# EAGLE design STM32F446RC_single layer V1 (EAGLE 9.2.0)
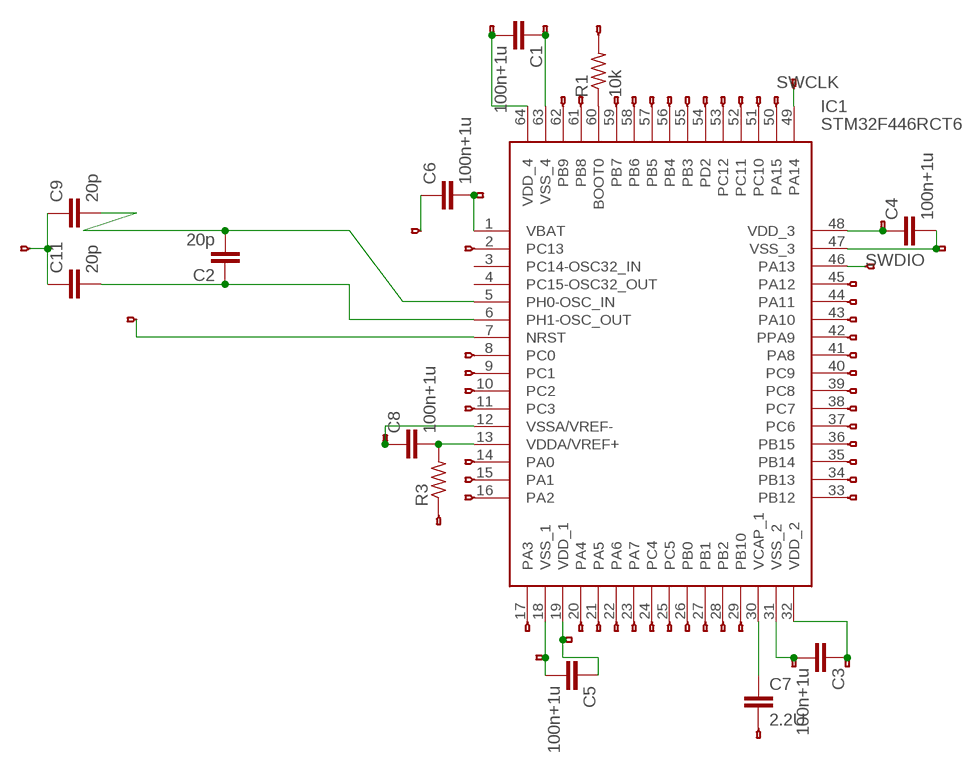
[diagram p0: schematic, sheet 1]

## Parts
C0  HEADERHOLE-HEADERHOLE  [1X1-HEADER-HOLE]
C1  100n+1u  C2,5-3  [C2.5-3]
C2  20p  C2,5-3  [C2.5-3]
C3  100n+1u  C2,5-3  [C2.5-3]
C4  100n+1u  C2,5-3  [C2.5-3]
C5  100n+1u  C2,5-3  [C2.5-3]
C6  100n+1u  C2,5-3  [C2.5-3]
C7  2.2U  C2,5-3  [C2.5-3]
C8  100n+1u  C2,5-3  [C2.5-3]
C9  20p  C2,5-3  [C2.5-3]
C11  20p  C2,5-3  [C2.5-3]
C13  HEADERHOLE-HEADERHOLE  [1X1-HEADER-HOLE]
IC1  STM32F446RCT6  [QFP50P1200X1200X160-64N]
JP1  HEADERHOLE-HEADERHOLE  [1X1-HEADER-HOLE]
JP2  HEADERHOLE-HEADERHOLE  [1X1-HEADER-HOLE]
JP3  HEADERHOLE-HEADERHOLE  [1X1-HEADER-HOLE]
JP4  HEADERHOLE-HEADERHOLE  [1X1-HEADER-HOLE]
JP5  HEADERHOLE-HEADERHOLE  [1X1-HEADER-HOLE]
JP6  HEADERHOLE-HEADERHOLE  [1X1-HEADER-HOLE]
JP7  HEADERHOLE-HEADERHOLE  [1X1-HEADER-HOLE]
JP9  HEADERHOLE-HEADERHOLE  [1X1-HEADER-HOLE]
JP10  HEADERHOLE-HEADERHOLE  [1X1-HEADER-HOLE]
JP11  HEADERHOLE-HEADERHOLE  [1X1-HEADER-HOLE]
JP12  HEADERHOLE-HEADERHOLE  [1X1-HEADER-HOLE]
JP13  HEADERHOLE-HEADERHOLE  [1X1-HEADER-HOLE]
JP14  HEADERHOLE-HEADERHOLE  [1X1-HEADER-HOLE]
JP15  HEADERHOLE-HEADERHOLE  [1X1-HEADER-HOLE]
JP16  HEADERHOLE-HEADERHOLE  [1X1-HEADER-HOLE]
JP17  HEADERHOLE-HEADERHOLE  [1X1-HEADER-HOLE]
JP18  HEADERHOLE-HEADERHOLE  [1X1-HEADER-HOLE]
JP19  HEADERHOLE-HEADERHOLE  [1X1-HEADER-HOLE]
JP20  HEADERHOLE-HEADERHOLE  [1X1-HEADER-HOLE]
JP21  HEADERHOLE-HEADERHOLE  [1X1-HEADER-HOLE]
JP22  HEADERHOLE-HEADERHOLE  [1X1-HEADER-HOLE]
JP23  HEADERHOLE-HEADERHOLE  [1X1-HEADER-HOLE]
JP24  HEADERHOLE-HEADERHOLE  [1X1-HEADER-HOLE]
JP25  HEADERHOLE-HEADERHOLE  [1X1-HEADER-HOLE]
JP27  HEADERHOLE-HEADERHOLE  [1X1-HEADER-HOLE]
JP28  HEADERHOLE-HEADERHOLE  [1X1-HEADER-HOLE]
JP30  HEADERHOLE-HEADERHOLE  [1X1-HEADER-HOLE]
JP31  HEADERHOLE-HEADERHOLE  [1X1-HEADER-HOLE]
JP32  HEADERHOLE-HEADERHOLE  [1X1-HEADER-HOLE]
JP33  HEADERHOLE-HEADERHOLE  [1X1-HEADER-HOLE]
JP34  HEADERHOLE-HEADERHOLE  [1X1-HEADER-HOLE]
JP35  HEADERHOLE-HEADERHOLE  [1X1-HEADER-HOLE]
JP36  HEADERHOLE-HEADERHOLE  [1X1-HEADER-HOLE]
JP37  HEADERHOLE-HEADERHOLE  [1X1-HEADER-HOLE]
JP38  HEADERHOLE-HEADERHOLE  [1X1-HEADER-HOLE]
JP39  HEADERHOLE-HEADERHOLE  [1X1-HEADER-HOLE]
JP40  HEADERHOLE-HEADERHOLE  [1X1-HEADER-HOLE]
JP41  HEADERHOLE-HEADERHOLE  [1X1-HEADER-HOLE]
JP42  HEADERHOLE-HEADERHOLE  [1X1-HEADER-HOLE]
JP43  HEADERHOLE-HEADERHOLE  [1X1-HEADER-HOLE]
JP44  HEADERHOLE-HEADERHOLE  [1X1-HEADER-HOLE]
JP45  HEADERHOLE-HEADERHOLE  [1X1-HEADER-HOLE]
JP46  HEADERHOLE-HEADERHOLE  [1X1-HEADER-HOLE]
JP47  HEADERHOLE-HEADERHOLE  [1X1-HEADER-HOLE]
JP48  HEADERHOLE-HEADERHOLE  [1X1-HEADER-HOLE]
JP49  HEADERHOLE-HEADERHOLE  [1X1-HEADER-HOLE]
JP50  HEADERHOLE-HEADERHOLE  [1X1-HEADER-HOLE]
JP51  HEADERHOLE-HEADERHOLE  [1X1-HEADER-HOLE]
JP52  HEADERHOLE-HEADERHOLE  [1X1-HEADER-HOLE]
JP53  HEADERHOLE-HEADERHOLE  [1X1-HEADER-HOLE]
JP54  HEADERHOLE-HEADERHOLE  [1X1-HEADER-HOLE]
JP55  HEADERHOLE-HEADERHOLE  [1X1-HEADER-HOLE]
JP56  HEADERHOLE-HEADERHOLE  [1X1-HEADER-HOLE]
JP57  HEADERHOLE-HEADERHOLE  [1X1-HEADER-HOLE]
JP58  HEADERHOLE-HEADERHOLE  [1X1-HEADER-HOLE]
JP59  HEADERHOLE-HEADERHOLE  [1X1-HEADER-HOLE]
JP61  HEADERHOLE-HEADERHOLE  [1X1-HEADER-HOLE]
JP62  HEADERHOLE-HEADERHOLE  [1X1-HEADER-HOLE]
JP63  HEADERHOLE-HEADERHOLE  [1X1-HEADER-HOLE]
JP65  HEADERHOLE-HEADERHOLE  [1X1-HEADER-HOLE]
R1  10k  R-US_0204/2V  [0204V]
R3  R-US_0204/2V  [0204V]

## Nets
N$1: C3.2 IC1.31(VSS_2) JP50.1
N$2: C8.2 IC1.13(VDDA/VREF+) R3.2
N$3: IC1.7(NRST) JP63.1
N$4: C5.2 IC1.18(VSS_1) JP20.1
N$5: IC1.60(BOOT0) R1.1
N$6: C1.2 IC1.64(VDD_4) JP58.1
N$7: C2.1 C11.2 IC1.6(PH1-OSC_OUT)
N$8: C1.1 IC1.63(VSS_4) JP57.1
N$9: IC1.59(PB7) JP43.1
N$10: IC1.58(PB6) JP42.1
N$11: IC1.24(PC4) JP12.1
N$12: IC1.25(PC5) JP23.1
N$13: IC1.26(PB0) JP22.1
N$14: IC1.27(PB1) JP17.1
N$15: IC1.28(PB2) JP16.1
N$16: IC1.29(PB10) JP14.1
N$17: IC1.23(PA7) JP11.1
N$18: IC1.22(PA6) JP9.1
N$19: IC1.21(PA5) JP19.1
N$20: IC1.17(PA3) JP24.1
N$21: IC1.33(PB12) JP18.1
N$22: IC1.34(PB13) JP13.1
N$23: IC1.35(PB14) JP6.1
N$24: IC1.36(PB15) JP10.1
N$25: IC1.37(PC6) JP1.1
N$26: IC1.16(PA2) JP36.1
N$27: IC1.15(PA1) JP35.1
N$28: IC1.14(PA0) JP34.1
N$29: IC1.11(PC3) JP4.1
N$30: IC1.10(PC2) JP3.1
N$31: IC1.9(PC1) JP27.1
N$32: C0.1 IC1.8(PC0)
N$33: C13.1 IC1.2(PC13)
N$34: IC1.38(PC7) JP15.1
N$35: IC1.39(PC8) JP2.1
N$36: IC1.40(PC9) JP30.1
N$37: IC1.41(PA8) JP28.1
N$38: IC1.42(PPA9) JP31.1
N$39: IC1.43(PA10) JP33.1
N$40: IC1.44(PA11) JP32.1
N$41: IC1.45(PA12) JP25.1
N$42: IC1.57(PB5) JP41.1
N$43: IC1.56(PB4) JP40.1
N$44: IC1.55(PB3) JP44.1
N$45: IC1.54(PD2) JP38.1
N$46: IC1.53(PC12) JP39.1
N$47: IC1.52(PC11) JP5.1
N$48: IC1.51(PC10) JP37.1
N$49: IC1.50(PA15) JP45.1
N$50: IC1.61(PB8) JP46.1
N$51: IC1.62(PB9) JP47.1
N$52: IC1.20(PA4) JP21.1
N$53: C2.2 C9.2 IC1.5(PH0-OSC_IN)
N$54: C7.2 JP49.1
N$55: C3.1 IC1.32(VDD_2) JP51.1
N$56: C4.2 IC1.47(VSS_3) JP52.1
N$57: JP56.1 R1.2
N$58: C6.2 IC1.1(VBAT) JP7.1
N$59: C8.1 IC1.12(VSSA/VREF-) JP62.1
N$60: JP61.1 R3.1
N$63: C9.1 C11.1 JP65.1
N$64: C5.1 IC1.19(VDD_1) JP48.1
N$66: C7.1 IC1.30(VCAP_1)
N$67: C6.1 JP59.1
N$89: C4.1 IC1.48(VDD_3) JP53.1
SWCLK: IC1.49(PA14) JP55.1
SWDIO: IC1.46(PA13) JP54.1
Unconnected: IC1.3(PC14-OSC32_IN) IC1.4(PC15-OSC32_OUT)

## Library data of the parts
C0 C13 JP1-JP3 JP5-JP7 JP9-JP25 JP27 JP28 JP30-JP59 JP61-JP63 JP65 = F405Pill:HEADERHOLE
C1-C9 C11 = capacitor-wima:C: CAPACITOR naming: grid - package width
IC1 = STM32F446RCT6:STM32F446RCT6: STMICROELECTRONICS - STM32F446RCT6 - MCU, 32BIT, CORTEX-M4, 180MHZ, LQFP-64 Source: Datasheet <https://componentsearchengine.com/Datasheets/1/STM32F446RCT6.pdf>; DESCRIPTION: STMICROELECTRONICS - STM32F446RCT6 - MCU, 32BIT, CORTEX-M4, 180MHZ, LQFP-64; HEIGHT: 1.6mm; MANUFACTURER_NAME: STMicroelectronics; MANUFACTURER_PART_NUMBER: STM32F446RCT6; MOUSER_PART_NUMBER: 511-STM32F446RCT6; MOUSER_PRICE-STOCK: https://www.mouser.com/Search/Refine.aspx?Keyword=511-STM32F446RCT6
JP4 = F405Pill:HEADERHOLE; SPICEPREFIX: X
R1 R3 = rcl:R-US_: RESISTOR, American symbol; SPICEPREFIX: R

## Board
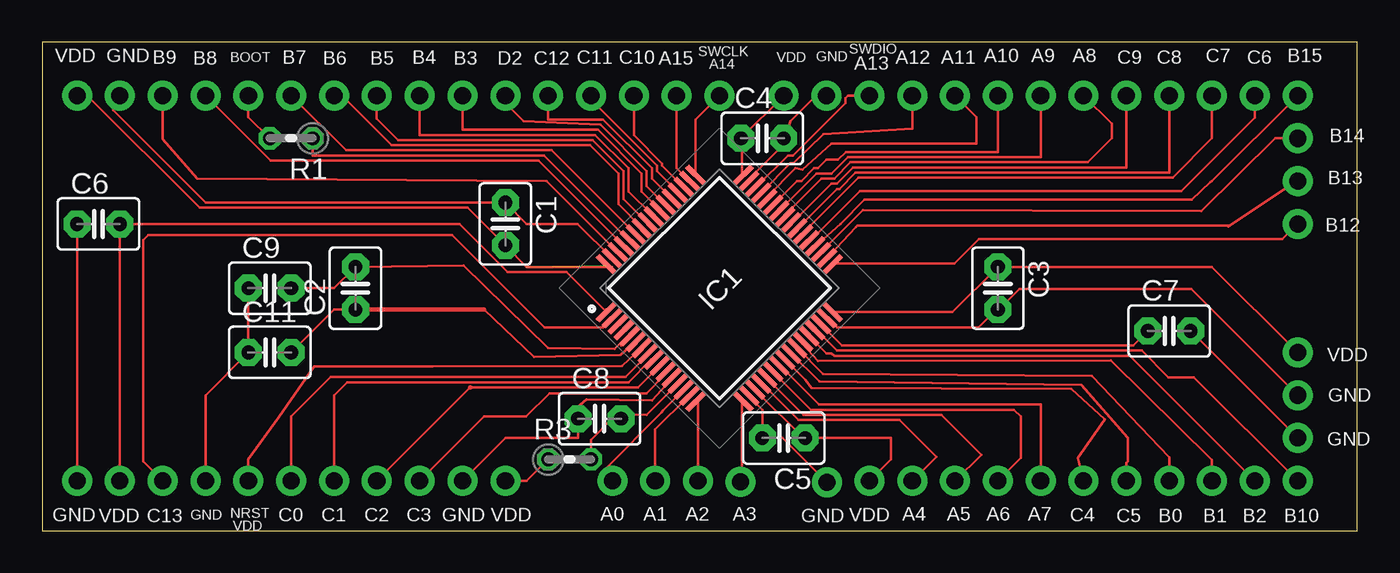
[diagram p1: board, top side]
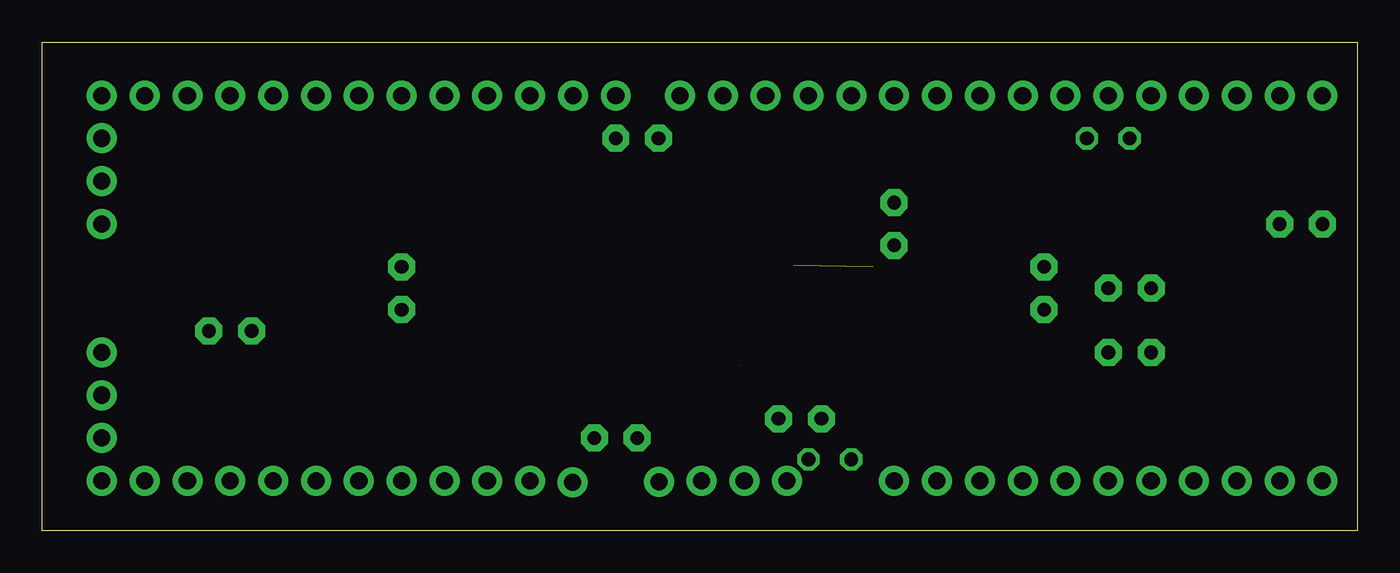
[diagram p2: board, bottom side, seen from below]

Size 78 x 29 mm. Coordinates in mm from the lower left corner, seen from the top.
Outline: 0,0 78,0 78,29 0,29 0,0
Copper layers (1*16): Top 0.035mm / dielectric 1.5mm / Bottom 0.035mm
Design rules "default": minimum track width 6mil, minimum drill 0.35mm, track to track 6mil, track to pad 6mil, pad to pad 6mil, via to via 6mil, smd to smd 6mil, copper to edge 40mil, drill to drill 6mil, minimum pad ring 10mil, minimum via ring 8mil, stop-mask expansion 4mil, vias tented up to drill 0mil, thermal gap 10mil

### Footprints (pad centres in the part's own frame; a part is rotated, then mirrored left to right if it is on the bottom)
1X1-HEADER-HOLE = drill 1.016 pad 1.778: 1 0,0
C2.5-3 = drill 0.813 pad 1.6 octagon: 1 -1.27,0; 2 1.27,0
QFP50P1200X1200X160-64N = smd 1.475 x 0.3: 1 -5.738,3.75; 2 -5.738,3.25; 3 -5.738,2.75; 4 -5.738,2.25; 5 -5.738,1.75; 6 -5.738,1.25; 7 -5.738,0.75; 8 -5.738,0.25; 9 -5.738,-0.25; 10 -5.738,-0.75; 11 -5.738,-1.25; 12 -5.738,-1.75; 13 -5.738,-2.25; 14 -5.738,-2.75; 15 -5.738,-3.25; 16 -5.738,-3.75; 33 5.738,-3.75; 34 5.738,-3.25; 35 5.738,-2.75; 36 5.738,-2.25; 37 5.738,-1.75; 38 5.738,-1.25; 39 5.738,-0.75; 40 5.738,-0.25; 41 5.738,0.25; 42 5.738,0.75; 43 5.738,1.25; 44 5.738,1.75; 45 5.738,2.25; 46 5.738,2.75; 47 5.738,3.25; 48 5.738,3.75 | smd 0.3 x 1.475: 17 -3.75,-5.738; 18 -3.25,-5.738; 19 -2.75,-5.738; 20 -2.25,-5.738; 21 -1.75,-5.738; 22 -1.25,-5.738; 23 -0.75,-5.738; 24 -0.25,-5.738; 25 0.25,-5.738; 26 0.75,-5.738; 27 1.25,-5.738; 28 1.75,-5.738; 29 2.25,-5.738; 30 2.75,-5.738; 31 3.25,-5.738; 32 3.75,-5.738; 49 3.75,5.738; 50 3.25,5.738; 51 2.75,5.738; 52 2.25,5.738; 53 1.75,5.738; 54 1.25,5.738; 55 0.75,5.738; 56 0.25,5.738; 57 -0.25,5.738; 58 -0.75,5.738; 59 -1.25,5.738; 60 -1.75,5.738; 61 -2.25,5.738; 62 -2.75,5.738; 63 -3.25,5.738; 64 -3.75,5.738
0204V = drill 0.813 octagon: 1 -1.27,0; 2 1.27,0

### Placement (x,y rotation side)
C0  14.77,2.97 0 top
C1  27.47,18.21 270 top
C2  18.58,14.4 90 top
C3  56.68,14.4 270 top
C4  42.71,23.29 0 top
C5  43.98,5.51 180 top
C6  3.34,18.21 0 top
C7  66.84,11.86 0 top
C8  33.06,6.65 0 top
C9  13.5,14.4 0 top
C11  13.5,10.59 0 top
C13  7.15,2.97 0 top
IC1  40.17,14.4 45 top
JP1  71.92,25.83 0 top
JP2  66.84,25.83 0 top
JP3  19.85,2.97 0 top
JP4  22.39,2.97 0 top
JP5  32.55,25.83 0 top
JP6  74.46,23.29 0 top
JP7  4.61,2.97 0 top
JP9  56.68,2.97 0 top
JP10  74.46,25.83 0 top
JP11  59.22,2.97 0 top
JP12  61.76,2.97 0 top
JP13  74.46,20.75 0 top
JP14  74.46,2.97 0 top
JP15  69.38,25.83 0 top
JP16  71.92,2.97 0 top
JP17  69.38,2.97 0 top
JP18  74.46,18.21 0 top
JP19  54.14,2.97 0 top
JP20  46.55,2.87 0 top
JP21  51.6,2.97 0 top
JP22  66.84,2.97 0 top
JP23  64.3,2.97 0 top
JP24  41.41,2.92 0 top
JP25  51.6,25.83 0 top
JP27  17.31,2.97 0 top
JP28  61.76,25.83 0 top
JP30  64.3,25.83 0 top
JP31  59.22,25.83 0 top
JP32  54.14,25.83 0 top
JP33  56.68,25.83 0 top
JP34  33.82,2.97 0 top
JP35  36.36,2.97 0 top
JP36  38.9,2.97 0 top
JP37  35.09,25.83 0 top
JP38  27.47,25.83 0 top
JP39  30.01,25.83 0 top
JP40  22.39,25.83 0 top
JP41  19.85,25.83 0 top
JP42  17.31,25.83 0 top
JP43  14.77,25.83 0 top
JP44  24.93,25.83 0 top
JP45  37.63,25.83 0 top
JP46  9.69,25.83 0 top
JP47  7.15,25.83 0 top
JP48  49.06,2.97 0 top
JP49  74.46,5.51 0 top
JP50  74.46,8.05 0 top
JP51  74.46,10.59 0 top
JP52  46.52,25.83 0 top
JP53  43.98,25.83 0 top
JP54  49.06,25.83 0 top
JP55  40.17,25.83 90 top
JP56  12.23,25.83 0 top
JP57  4.61,25.83 0 top
JP58  2.07,25.83 0 top
JP59  2.07,2.97 0 top
JP61  27.47,2.97 0 top
JP62  24.93,2.97 0 top
JP63  12.23,2.97 0 top
JP65  9.69,2.97 0 top
R1  14.77,23.29 180 top
R3  31.28,4.24 0 top

### Tracks (layer width: path | path; a pad name or v marks a point on that pad's centre or on a via)
N$1
  Top 0.152: IC1.31 46.67,12.52 47.13,12.06 55.51,12.06 56.58,13.13 C3.2 56.73,13.13 57.95,14.35 68.16,14.35 JP50.1
N$2
  Top 0.152: IC1.13 37.68,8.71 35.85,6.88 33.93,6.94 34.27,6.6 | R3.2 32.55,5.41 33.87,6.73 34.33,6.69
N$3
  Top 0.152: IC1.7 34.4,9.8 23.15,9.77 16.12,9.76 14.02,6.74 12.23,4.24 JP63.1
N$4
  Top 0.152: IC1.18 41.95,7.95 42.71,7.19 C5.2 43.91,5.51 JP20.1
N$5
  Top 0.152: 34.88,17.23 34.78,17.25 29.76,22.27 16.04,22.27 R1.1
N$6  (1 unrouted)
  Top 0.152: 33.47,15.8 33.4,15.73 | 27.47,16.99 C1.2 | C1.2 28.74,15.67 33.77,15.67 33.79,15.64 | JP58.1 2.68,25.83 9.33,19.18 25.23,19.18 C1.2
  Bottom 0.152: 2.17,25.73 JP58.1 | 27.47,16.99 C1.2
N$7
  Top 0.152: 35.21,11.24 34.3,10.43 29.17,10.31 26.2,13.13 | 14.83,10.68 14.76,10.6 | C2.1 17.31,13.13 C11.2
  Top 0.254: 26.2,13.13 C2.1
N$8
  Top 0.152: IC1.63 33.72,16.17 | C1.1 27.47,19.43 | 27.47,19.58 C1.1 | C1.1 9.69,19.48 4.2,24.97 4.2,25.42 JP57.1 | C1.1 28.74,18.21 31.76,18.21 IC1.63
N$9
  Top 0.152: JP43.1 18.02,22.58 30.21,22.58 35.09,17.7 IC1.59
N$10
  Top 0.152: 35.59,17.94 35.55,18.01 34.18,19.38 34.18,21.21 32.5,22.88 20.71,22.88 17.54,26.06 JP42.1
N$11
  Top 0.152: IC1.24 45.27,8.95 45.64,8.48 61.03,8.43 63.03,6.6 61.42,4.32 JP12.1
N$12
  Top 0.152: 44.41,10.53 46.09,8.86 61.62,8.67 64.4,5.51 64.4,4.14 64.3,4.04 JP23.1
N$13
  Top 0.152: IC1.26 46.31,9.32 62.25,9.2 66.84,4.38 JP22.1
N$14
  Top 0.152: 45.1,11.22 45.1,11.1 46.01,10.08 63.38,10.12 69.38,4.21 JP17.1
N$15
  Top 0.152: JP16.1 64.5,10.39 46.98,10.39 46.83,10.54 46.52,10.54 45.61,11.45 IC1.28
N$16
  Top 0.152: JP14.1 68.31,9.12 66.79,9.12 65.21,10.69 47.13,10.69 45.91,11.92 IC1.29
N$17
  Top 0.152: JP11.1 59.22,7.49 46.06,7.49 43.78,9.78 43.71,9.82
N$18
  Top 0.152: IC1.22 43.47,9.32 45.61,7.19 57.65,7.19 58.05,6.78 58.05,4.34 JP9.1
N$19
  Top 0.152: 43,9.11 43.02,9.02 45.15,6.88 53.33,6.88 55.69,4.52 JP19.1
N$20
  Top 0.152: JP24.1 41.49,2.92 41.49,7.64 41.57,7.7
N$21
  Top 0.152: JP18.1 73.56,17.31 55.55,17.31 54.11,15.87 46.98,15.87 46.89,15.8
N$22
  Top 0.152: IC1.34 46.69,16.32 46.69,16.34 48.28,18.02 48.37,18.11 70.43,18.11 | JP13.1 74.39,20.75 70.43,18.11 | 70.43,18.11 70.35,18.06
N$23
  Top 0.152: JP6.1 73.14,23.29 68.76,18.98 48.68,19.02 46.27,16.63 IC1.35
N$24
  Top 0.152: IC1.36 47.33,18.21 48.76,19.64 68.17,19.64 69.29,20.69 69.38,20.75 JP10.1
N$25
  Top 0.152: JP1.1 71.92,24.51 67.56,20.15 48.51,20.15 45.61,17.25 45.47,17.23
N$26
  Top 0.152: IC1.16 38.9,7.55 JP36.1
N$27
  Top 0.152: JP35.1 36.36,6.02 38.29,7.95 IC1.15
N$28
  Top 0.152: IC1.14 36.82,7.16 36.73,7.03 33.45,3.71 33.91,3.06
N$29
  Top 0.152: JP4.1 26.2,6.78 28.71,6.78 30.11,8.16 35.85,8.15 36.94,9.29 37.01,9.44
N$30  (1 unrouted)
  Top 0.152: 36.77,9.93 IC1.10 | 25.39,8.51 JP3.1 | IC1.10 35.34,8.51 25.4,8.51
  Top 0.254: 25.4,8.51 25.39,8.51
  Bottom 0.152: 19.85,3.07 JP3.1
N$31
  Top 0.152: 36.28,10.18 36.17,10.07 | IC1.9 36.12,10.17 34.77,8.82 18.08,8.82 17.31,8.05 JP27.1
N$32
  Top 0.152: 36.21,10.74 36,10.54 34.61,9.14 33.98,9.14 33.97,9.13 33.86,9.14 17.11,9.14 14.77,6.8 C0.1 | 36,10.53 IC1.8
N$33
  Top 0.152: IC1.2 33.72,12.52 33.26,12.06 29.81,12.06 24.32,17.55 6.29,17.55 5.98,17.25 5.98,4.14 C13.1
N$34
  Top 0.152: JP15.1 69.38,23.29 67.04,20.95 48.4,20.95 45.15,17.7 45.13,17.57
N$35
  Top 0.152: JP2.1 66.84,21.26 48.25,21.26 47.28,20.29 47.13,20.29 44.84,18.01 IC1.39
N$36
  Top 0.152: JP30.1 64.3,21.56 48.09,21.56 47.13,20.6 46.83,20.6 44.54,18.31 44.4,18.3
N$37
  Top 0.152: JP28.1 63.44,24.15 63.44,23.29 62.01,21.87 47.94,21.87 46.98,20.9 46.22,20.9 44.08,18.77 44.07,18.63
N$38
  Top 0.152: IC1.42 43.78,19.07 45.91,21.21 46.83,21.21 47.79,22.17 59.22,22.17 JP31.1
N$39
  Top 0.152: IC1.43 43.33,19.23 | IC1.43 44.75,20.75 45.02,20.75 45.78,21.51 46.01,21.51 46.52,22.02 47.21,22.02 47.66,22.48 56.68,22.48 JP33.1
  Bottom 0.152: JP33.1 56.68,25.78
N$40
  Top 0.152: 43,19.7 43.02,19.84 44.69,21.51 45.09,21.42 46.83,22.98 55.41,22.98 55.41,24.56 JP32.1
N$41
  Top 0.152: IC1.45 42.72,20.14 44.39,21.82 44.56,21.82 46.34,23.55 51.6,23.87 JP25.1
N$42
  Top 0.152: JP41.1 19.85,24.46 21.12,23.19 32.65,23.19 34.48,21.36 34.48,19.68 35.85,18.31 35.94,18.3
N$43
  Top 0.152: IC1.56 36.16,18.77 34.78,20.14 34.78,21.51 32.8,23.49 22.39,23.49 JP40.1
N$44
  Top 0.152: JP44.1 24.93,23.8 32.96,23.8 35.55,21.21 35.55,20.14 36.61,19.07 36.63,18.99
N$45
  Top 0.152: 36.99,19.33 36.92,19.38 35.85,20.45 35.85,21.36 33.11,24.1 28.55,24.32 27.25,25.61
N$46
  Top 0.152: IC1.53 37.22,19.84 36.16,20.9 36.16,21.51 33.26,24.41 30.01,24.41 JP39.1
N$47
  Top 0.152: JP5.1 32.55,25.58 36.46,21.66 36.46,21.36 37.68,20.14 IC1.52
N$48
  Top 0.152: IC1.51 37.99,20.45 36.77,21.66 36.77,21.79 35.09,23.47 JP37.1
N$49
  Top 0.152: JP45.1 37.63,21.54 IC1.50
N$50
  Top 0.152: IC1.61 34.48,16.94 29.45,21.97 13.55,21.97 JP46.1
N$51
  Top 0.152: IC1.62 34.02,16.64 29.91,20.75 9.18,20.9 7.15,23.24 JP47.1
N$52
  Top 0.152: IC1.20 42.71,8.71 44.84,6.58 50.84,6.58 53.02,4.39 JP21.1
N$53
  Top 0.152: 34.33,11 34.78,11.45 IC1.5 | 14.83,14.49 14.76,14.41 | 34.81,11.64 33.95,10.78 30.01,10.84 24.99,15.73 C2.2 17.31,14.4 C9.2
N$54
  Top 0.152: JP49.1 C7.2
  Bottom 0.152: 74.47,5.52 74.4,5.6
N$55
  Top 0.152: IC1.32 46.98,12.98 53.99,12.98 C3.1 69.38,15.67 JP51.1
N$56
  Top 0.152: IC1.47 41.95,20.9 43.93,22.88 43.92,23.2 43.99,23.28 44.08,23.34 44.39,24.31 46.22,26.14
N$57
  Top 0.152: JP56.1 12.23,24.56 R1.2
  Bottom 0.152: 12.32,25.77 12.24,25.84
N$58
  Top 0.152: 33.44,13.13 33.44,12.99 | IC1.1 31.09,15.37 27.59,15.37 24.75,18.21 C6.2 JP7.1
N$59
  Top 0.152: IC1.12 37.27,8.96 36.16,7.75 32.3,7.8 31.69,7.29 31.79,7.22 C8.1 31.79,5.51 27.47,5.51 JP62.1 | 24.99,3.06 24.92,2.98 | 31.79,6.69 31.28,6.69
N$60
  Top 0.152: 29.91,4.24 R3.1 28.74,2.97 JP61.1
N$63
  Top 0.152: C9.1 C11.1 9.69,8.05 JP65.1
N$64
  Top 0.152: IC1.19 42.41,8.25 45.15,5.51 C5.1 50.33,5.51 50.33,4.24 JP48.1
N$66
  Top 0.152: IC1.30 46.22,12.22 47.43,11 64.71,11 C7.1
N$67
  Top 0.152: C6.1 JP59.1
  Bottom 0.152: JP59.1 1.97,3.07
N$89
  Top 0.152: IC1.48 41.49,21.21 41.5,23.2 41.43,23.28 | JP53.1 C4.1
SWCLK
  Top 0.152: JP55.1 38.75,24.41 38.75,21.21 IC1.49
SWDIO
  Top 0.152: 42.28,20.42 42.41,20.45 44.22,22.26 44.53,22.26 47.64,25.37 47.64,25.68 47.79,25.83 JP54.1

### Text on the board
tPlace: VDD | GND | B9 | B8 | BOOT | B7 | B6 | B5 | B4 | B3 | D2 | C12 | C11 | C10 | A15 | SWCLK | VDD | GND | SWDIO | A12 | A11 | A10 | A9 | A8 | C9 | C8 | C7 | C6 | B15 | A14 | A13 | B14 | B13 | B12 | VDD | GND | GND | GND | GND | NRST | C0 | C1 | C2 | C3 | GND | VDD | A0 | A1 | A2 | A3 | VDD | A4 | A5 | A6 | A7 | C4 | VDD | C13 | VDD | GND | C5 | B0 | B1 | B2 | B10